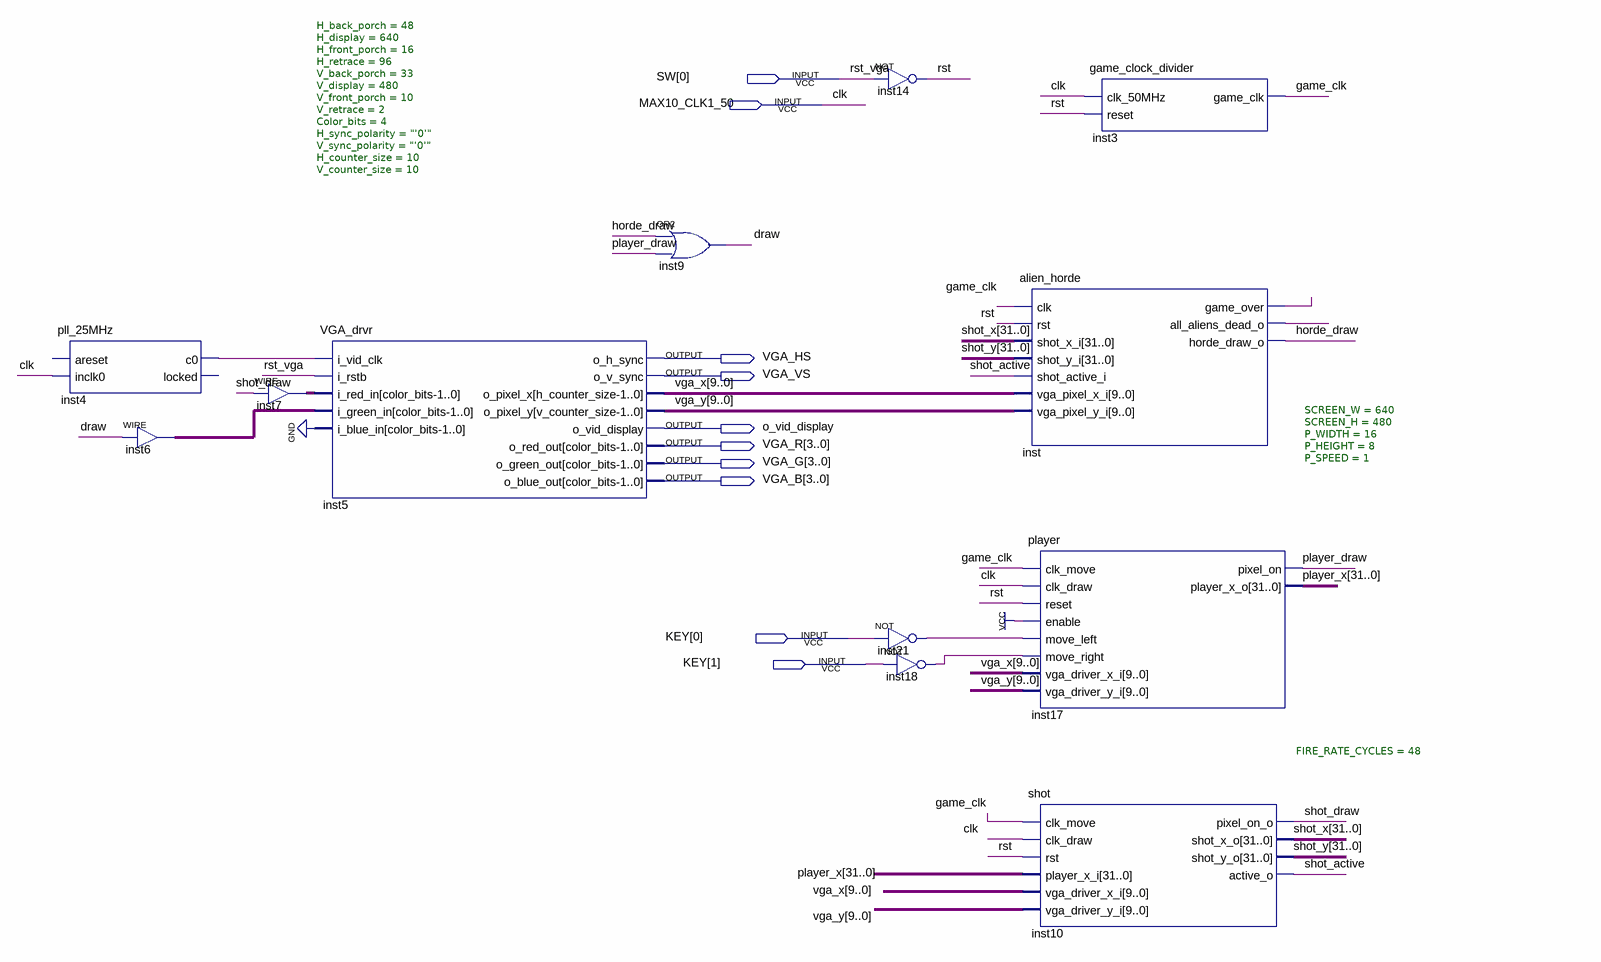
[diagram p0: schematic sheet]
// Quartus schematic spaceInvaders.bdf as structural Verilog: 12 symbols, 10 pins
module spaceInvaders (
  input  [0:0] SW,
  input  MAX10_CLK1_50,
  input  [1:0] KEY,
  output VGA_HS,
  output VGA_VS,
  output o_vid_display,
  output [3:0] VGA_R,
  output [3:0] VGA_G,
  output [3:0] VGA_B
);

  wire draw, game_clk, horde_draw, inst4_c0, inst18_out, inst21_out, inst_all_aliens_dead_o, inst_game_over,
       player_draw, rst, shot_active, shot_draw;
  wire [3:0] inst6_out, inst7_out;
  wire [9:0] vga_x, vga_y;
  wire [31:0] player_x, shot_x, shot_y;

  pll_25MHz inst4 (.inclk0(MAX10_CLK1_50), .c0(inst4_c0));  // open: areset, locked
  assign inst6_out = {4{draw}};  // WIRE inst6
  assign inst7_out = {4{shot_draw}};  // WIRE inst7
  VGA_drvr #(.H_back_porch(48), .H_display(640), .H_front_porch(16), .H_retrace(96), .V_back_porch(33), .V_display(480), .V_front_porch(10), .V_retrace(2), .Color_bits(4), .H_sync_polarity("'0'"), .V_sync_polarity("'0'"), .H_counter_size(10), .V_counter_size(10)) inst5 (
    .i_vid_clk(inst4_c0), .i_rstb(SW[0]), .i_red_in(inst7_out), .i_green_in(inst6_out), .i_blue_in(4'b0000),
    .o_h_sync(VGA_HS), .o_v_sync(VGA_VS), .o_pixel_x(vga_x), .o_pixel_y(vga_y),
    .o_vid_display(o_vid_display), .o_red_out(VGA_R), .o_green_out(VGA_G), .o_blue_out(VGA_B));
  or inst9 (draw, horde_draw, player_draw);
  not inst14 (rst, SW[0]);
  not inst21 (inst21_out, KEY[0]);
  not inst18 (inst18_out, KEY[1]);
  alien_horde inst (
    .clk(game_clk), .rst(rst), .shot_x_i(shot_x), .shot_y_i(shot_y), .shot_active_i(shot_active),
    .vga_pixel_x_i(vga_x), .vga_pixel_y_i(vga_y), .game_over(inst_game_over),
    .all_aliens_dead_o(inst_all_aliens_dead_o), .horde_draw_o(horde_draw));
  player #(.SCREEN_W(640), .SCREEN_H(480), .P_WIDTH(16), .P_HEIGHT(8), .P_SPEED(1)) inst17 (
    .clk_move(game_clk), .clk_draw(MAX10_CLK1_50), .reset(rst), .enable(1'b1), .move_left(inst21_out),
    .move_right(inst18_out), .vga_driver_x_i(vga_x), .vga_driver_y_i(vga_y), .pixel_on(player_draw),
    .player_x_o(player_x));
  shot #(.FIRE_RATE_CYCLES(48)) inst10 (
    .clk_move(game_clk), .clk_draw(MAX10_CLK1_50), .rst(rst), .player_x_i(player_x), .vga_driver_x_i(vga_x),
    .vga_driver_y_i(vga_y), .pixel_on_o(shot_draw), .shot_x_o(shot_x), .shot_y_o(shot_y),
    .active_o(shot_active));
  game_clock_divider inst3 (.clk_50MHz(MAX10_CLK1_50), .reset(rst), .game_clk(game_clk));

  // Other names for the same wires on the sheet: clk = MAX10_CLK1_50; rst_vga = SW[0]
endmodule
